# EAGLE design Oraculo V1 (EAGLE 9.4.0)
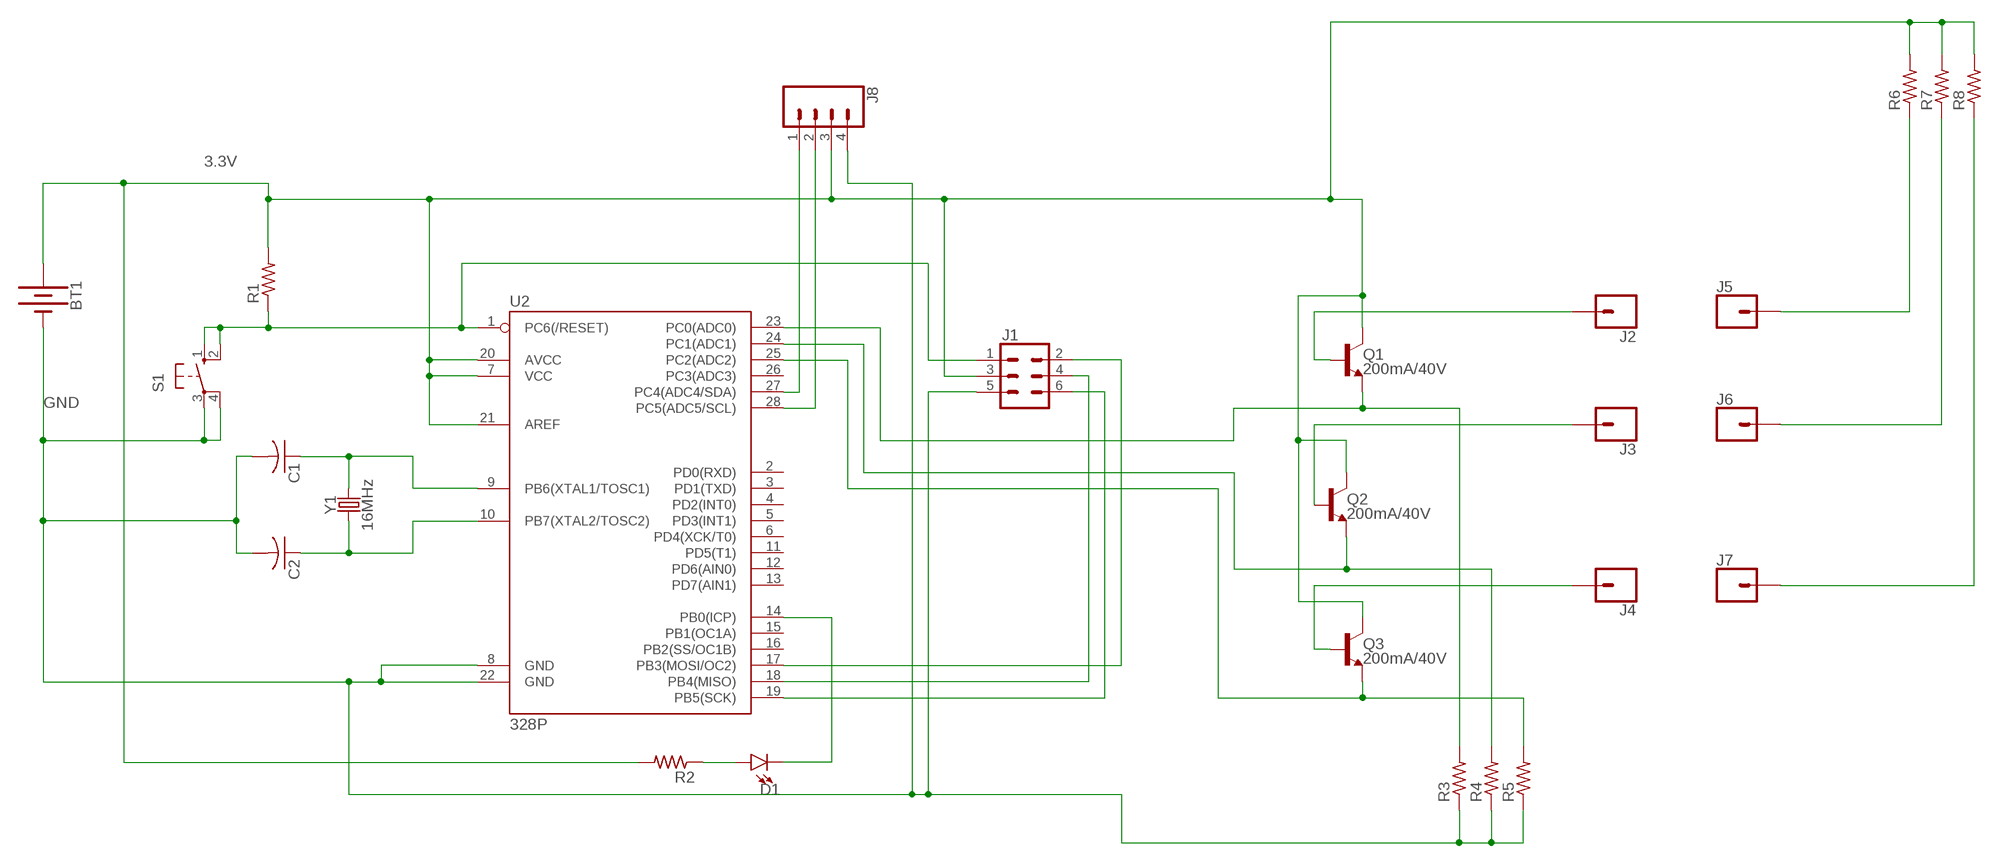
[diagram p0: schematic, sheet 1]

## Parts
BT1  BATTERY-20MM_PTH  [BATTCOM_20MM_PTH]
C1  C-US050-025X075  [C050-025X075]
C2  C-US050-025X075  [C050-025X075]
D1  LED5MM  [LED_5MM]
J1  CONN_03X2NO_SILK  [2X3-NS]
J2  CONN_01  [1X01]
J3  CONN_01  [1X01]
J4  CONN_01  [1X01]
J5  CONN_01  [1X01]
J6  CONN_01  [1X01]
J7  CONN_01  [1X01]
J8  CONN_04  [1X04]
Q1  200mA/40V  TRANS_NPN-2N3904  [TO-92]
Q2  200mA/40V  TRANS_NPN-2N3904  [TO-92]
Q3  200mA/40V  TRANS_NPN-2N3904  [TO-92]
R1  R-US_0204/7  [0204/7]
R2  R-US_0204/7  [0204/7]
R3  R-US_0204/7  [0204/7]
R4  R-US_0204/7  [0204/7]
R5  R-US_0204/7  [0204/7]
R6  R-US_0204/7  [0204/7]
R7  R-US_0204/7  [0204/7]
R8  R-US_0204/7  [0204/7]
S1  10-XX  [B3F-10XX]
U2  328P  ATMEGA328P_PDIP  [DIP28]
Y1  16MHz  CRYSTAL-16MHZPTH-HC49US  [HC49US]

## Nets
3.3V: BT1.1(+) J1.3 J8.3 Q1.3(C) Q2.3(C) Q3.3(C) R1.2 R2.2 R6.2 R7.2 R8.2 U2.7(VCC) U2.20(AVCC) U2.21(AREF)
GND: BT1.2(-) C1.2 C2.2 J1.5 J8.4 R3.1 R4.1 R5.1 S1.3(P) S1.4(P1) U2.8(GND) U2.22(GND)
N$1: C1.1 U2.9(PB6(XTAL1/TOSC1)) Y1.2
N$2: C2.1 U2.10(PB7(XTAL2/TOSC2)) Y1.1
N$3: J1.1 R1.1 S1.1(S) S1.2(S1) U2.1(PC6(/RESET))
N$5: J1.2 U2.17(PB3(MOSI/OC2))
N$7: D1.K(C) U2.14(PB0(ICP))
N$8: J1.6 U2.19(PB5(SCK))
N$9: J1.4 U2.18(PB4(MISO))
N$10: D1.A R2.1
N$11: J8.1 U2.27(PC4(ADC4/SDA))
N$12: J2.1 Q1.2(B)
N$13: J3.1 Q2.2(B)
N$14: J4.1 Q3.2(B)
N$15: Q1.1(E) R3.2 U2.23(PC0(ADC0))
N$16: Q2.1(E) R4.2 U2.24(PC1(ADC1))
N$17: Q3.1(E) R5.2 U2.25(PC2(ADC2))
N$18: J5.1 J6.1 J7.1 R6.1 R7.1 R8.1
N$19: J8.2 U2.28(PC5(ADC5/SCL))
Unconnected: U2.2(PD0(RXD)) U2.3(PD1(TXD)) U2.4(PD2(INT0)) U2.5(PD3(INT1)) U2.6(PD4(XCK/T0)) U2.11(PD5(T1)) U2.12(PD6(AIN0)) U2.13(PD7(AIN1)) U2.15(PB1(OC1A)) U2.16(PB2(SS/OC1B)) U2.26(PC3(ADC3))

## Library data of the parts
BT1 = SparkFun-Batteries:BATTERY: Battery - Single Cell A variety of battery chemistries, sizes, and footprints. Device List: 20MM_PTH - Coin Cell Battery Holder - 20mm (PTH) <https://www.sparkfun.com/products/783> 6.8MM_PTH - Coin Cell Battery Holder - 6.8MM(SMD) <https://www.digikey.com/product-detail/en/seiko-instruments/MS621FE-FL11E/728-1057-ND/1889208?WT.srch=1&gclid=CNOQ5a6LzdQCFZS2wAodXCkE0g> 12MM_SMD - Coin Cell Battery Holder - 12mm (SMD) <https://www.sparkfun.com/products/10592> 12MM_PTH - Coin Cell Battery Holder - 12mm (PTH) <https://www.sparkfun.com/products/7948> 20MM_SMD - 20mm Coin Cell Battery Holder (SMD) (2 legs) Used on the Big Time Watch Kit <https://www.sparkfun.com/products/11734> 20MM_SMD_4LEGS - Coin Cell Battery Holder - 20mm (SMD) <https://www.sparkfun.com/products/11892> 20MM_SMD_4LEGS_OVERPASTE - Coin Cell Battery Holder - 20mm (SMD) <https://www.sparkfun.com/products/11892> (Over-paste on the legs) 24.5MM_PTH - Coin Cell Battery Holder - 24.5mm (PTH) <https://www.sparkfun.com/products/8863> 9V - 9V Battery Holder - PC Mount Used on the SparkFun SparkPunk Sound Kit <https://www.sparkfun.com/products/11177> and SparkFun SparkPunk Sequencer Kit <https://www.sparkfun.com/products/12707> 18650 - Battery Holder - 18650 (PTH) <https://www.sparkfun.com/products/13113> AA - Battery Holder - 1xAA (PTH) <https://www.sparkfun.com/products/7949> AAA - Battery Holder - 1xAAA (PTH) <https://www.sparkfun.com/products/12718> AA_KIT - Battery Holder - 1xAA (PTH) <https://www.sparkfun.com/products/7949> Special kit package - pads only have exposed copper on one side of the board. AAA_KIT - Battery Holder - 1xAAA (PTH) <https://www.sparkfun.com/products/12718> Special kit package - pads only have exposed copper on one side of the board.; PROD_ID: BATT-09031; SF_SKU: PRT-00783
C1 C2 = rcl:C-US: CAPACITOR, American symbol; SPICEPREFIX: C
D1 = SparkFun-LED:LED: LED (Generic) Standard schematic elements and footprints for 5mm, 3mm, 1206, and 0603 sized LEDs. Generic LEDs with no color specified.
J1 = SparkFun-Connectors:CONN_03X2: Multi connection point. Often used as Generic Header-pin footprint for 0.1 inch spaced/style header connections You can populate with any combo of single row headers, but if you'd like an exact match, check these: Header - 2x3 (Male, 0.1") <https://www.sparkfun.com/products/12807> (PRT-12807) Header - 2x3 (Female, 0.1") <https://www.sparkfun.com/products/13010> (PRT-13010) 2x3 Pin Shrouded Header <https://www.sparkfun.com/products/10877> (PRT-10877) On any of the 0.1 inch spaced packages, you can populate with these: Break Away Headers - Straight <https://www.sparkfun.com/products/116> (PRT-00116) Break Away Male Headers - Right Angle <https://www.sparkfun.com/products/553> (PRT-00553) Female Headers <https://www.sparkfun.com/products/115> (PRT-00115) Break Away Headers - Machine Pin <https://www.sparkfun.com/products/117> (PRT-00117) Break Away Female Headers - Swiss Machine Pin <https://www.sparkfun.com/products/743> (PRT-00743) Special note: the shrouded connector mates well with our 3x2 ribbon cables: Ribbon Crimp Connector - 6-pin (2x3, Female) <https://www.sparkfun.com/products/10651> (PRT-10651) Ribbon Cable - 6 wire (15ft) <https://www.sparkfun.com/products/10646> (PRT-10646)
J2-J7 = SparkFun-Connectors:CONN_01: Single connection point. Often used as Generic Header-pin footprint for 0.1 inch spaced/style header connections On any of the 0.1 inch spaced packages, you can populate with these: Break Away Headers - Straight <https://www.sparkfun.com/products/116> (PRT-00116) Break Away Male Headers - Right Angle <https://www.sparkfun.com/products/553> (PRT-00553) Female Headers <https://www.sparkfun.com/products/115> (PRT-00115) Break Away Headers - Machine Pin <https://www.sparkfun.com/products/117> (PRT-00117) Break Away Female Headers - Swiss Machine Pin <https://www.sparkfun.com/products/743> (PRT-00743) This device is also useful as a general connection point to wire up your design to another part of your project. Our various solder wires solder well into these plated through hole pads. Hook-Up Wire - Assortment (Stranded, 22 AWG) <https://www.sparkfun.com/products/11375> (PRT-11375) Hook-Up Wire - Assortment (Solid Core, 22 AWG) <https://www.sparkfun.com/products/11367> (PRT-11367) View the entire wire category on our website here <https://www.sparkfun.com/categories/141> Special notes: SMTSO-256-ET is a "flush mount" nut for a 4-40 screw. We mostly use this on specialty testbeds; it is a nice way to connect hardware to your PCB at an adjustable hieght. Also note, the SNAP packages are for using a snappable style connector. We sell a baggie of snaps and they are also used on two LilyPad designs: Snap Assortment - 30 pack (male and female) <https://www.sparkfun.com/products/11347> (DEV-11347) LilyPad Arduino SimpleSnap <https://www.sparkfun.com/products/10941> (DEV-10941) LilyPad SimpleSnap Protoboard <https://www.sparkfun.com/products/10940> (DEV-10940)
J8 = SparkFun-Connectors:CONN_04: Multi connection point. Often used as Generic Header-pin footprint for 0.1 inch spaced/style header connections On any of the 0.1 inch spaced packages, you can populate with these: Break Away Headers - Straight <https://www.sparkfun.com/products/116> (PRT-00116) Break Away Male Headers - Right Angle <https://www.sparkfun.com/products/553> (PRT-00553) Female Headers <https://www.sparkfun.com/products/115> (PRT-00115) Break Away Headers - Machine Pin <https://www.sparkfun.com/products/117> (PRT-00117) Break Away Female Headers - Swiss Machine Pin <https://www.sparkfun.com/products/743> (PRT-00743) For SCREWTERMINALS and SPRING TERMINALS visit here: Screw Terimnals on SparkFun.com <https://www.sparkfun.com/search/results?term=Screw+Terminals> (5mm/3.5mm/2.54mm spacing) This device is also useful as a general connection point to wire up your design to another part of your project. Our various solder wires solder well into these plated through hole pads. Hook-Up Wire - Assortment (Stranded, 22 AWG) <https://www.sparkfun.com/products/11375> (PRT-11375) Hook-Up Wire - Assortment (Solid Core, 22 AWG) <https://www.sparkfun.com/products/11367> (PRT-11367) View the entire wire category on our website here <https://www.sparkfun.com/categories/141> Special notes: Molex polarized connector foot print use with SKU : PRT-08231 with associated crimp pins and housings. 1MM SMD Version SKU: PRT-10208; PROD_ID: CONN-09696
Q1-Q3 = SparkFun-DiscreteSemi:TRANS_NPN: NPN transistor Current controlled devices typically used to amplify current or used as a switch. BC547 - COM-08928 <http://www.sparkfun.com/products/8928> (TO-92 45V 100mA) (1.Collector 2.Base 3.Emitter) 2N3904 - COM-00521 <http://www.sparkfun.com/products/521> (TO-92 40V 200mA) (1.Emitter 2.Base 3.Collector) P2N2222A - COM-12852 <http://www.sparkfun.com/products/12852> (TO-92 40V 600mA) (1.Collector 2.Base 3.Emitter); PROD_ID: TRANS-08447
R1-R8 = rcl:R-US_: RESISTOR, American symbol; SPICEPREFIX: R
S1 = switch-omron:10-XX: OMRON SWITCH; MPN: B3F-1000; OC_FARNELL: 176432; OC_NEWARK: 36M3542
U2 = SparkFun-IC-Microcontroller:ATMEGA328P_PDIP: Atmel 328P Through hole ATMEGA328P uC used in the Arduino 32kb flash, 1k EEPROM, 2k SRAM Datasheet <http://www.sparkfun.com/datasheets/Components/SMD/ATMega328.pdf> SparkFun Products Storefront component: AVR 28 Pin 20MHz 32K 6A/D - ATMega328P <https://www.sparkfun.com/products/9061> (COM-09061) SparkFun Simon Says - Through-Hole Soldering Kit <https://www.sparkfun.com/products/10547> (KIT-10547) SparkFun Learn to Solder - Simon Says <https://www.sparkfun.com/products/13708> (KIT-13708) SparkFun BigTime Watch Kit <https://www.sparkfun.com/products/11734> (KIT-11734) SparkFun ClockIt <https://www.sparkfun.com/products/10930> (KIT-10930) SparkFun Serial Enabled LCD Kit <https://www.sparkfun.com/products/10097> (LCD-10097) SparkFun Simon Tilts - Through Hole Soldering Kit <https://www.sparkfun.com/products/12634> (KIT-12634) SparkFun Frequency Counter Kit <https://www.sparkfun.com/products/10140> (KIT-10140) FabFM Radio Kit <https://www.sparkfun.com/products/11043> (KIT-11043) SparkFun Binary Blaster Kit <https://www.sparkfun.com/products/12037> (KIT-12037) SparkFun Metro-Gnome <https://www.sparkfun.com/products/9236> (KIT-09236) ATmega328 with Arduino Optiboot (Uno) <https://www.sparkfun.com/products/10524> (DEV-10524); PROD_ID: IC-09136
Y1 = SparkFun-Clocks:CRYSTAL-16MHZ: 16MHz Crystal Digikey Example <http://www.digikey.com/product-search/en?keywords=535-9122-1-ND> Frequency: 16MHz Frequency Stability: ±50ppm Frequency Tolerance: ±20ppm Load Capacitance: 18pF SparkFun Products: Pro Micro -5V/16MHz <https://www.sparkfun.com/products/12640> SparkFun Serial Enabled LCD Kit <https://www.sparkfun.com/products/10097>; PROD_ID: XTAL-08181; SF_ID: COM-00536

## Board
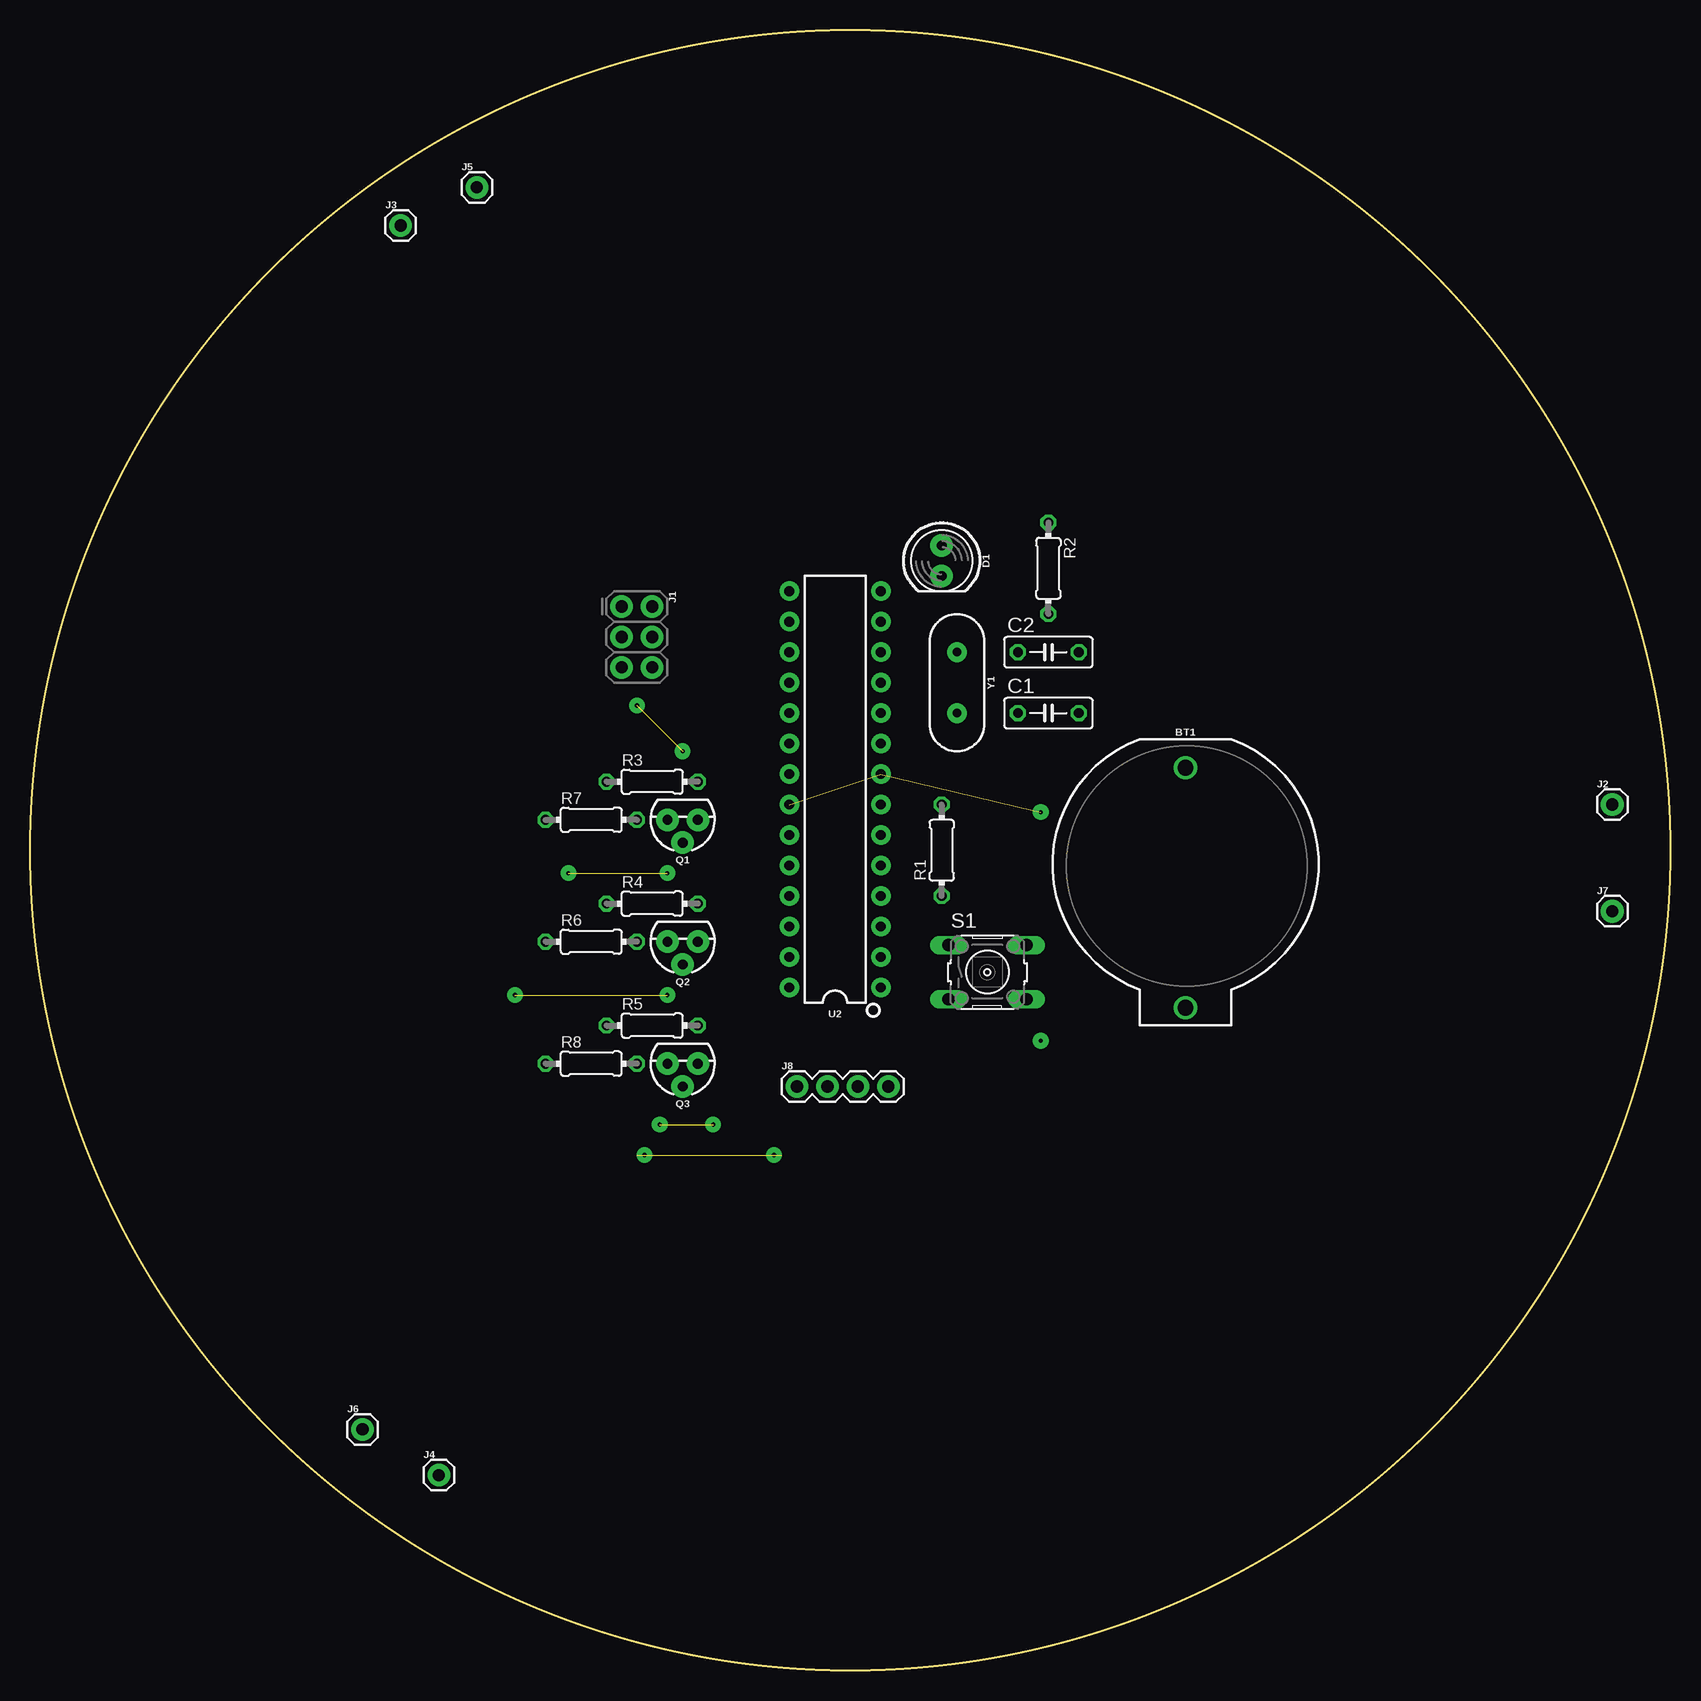
[diagram p1: board, top side]
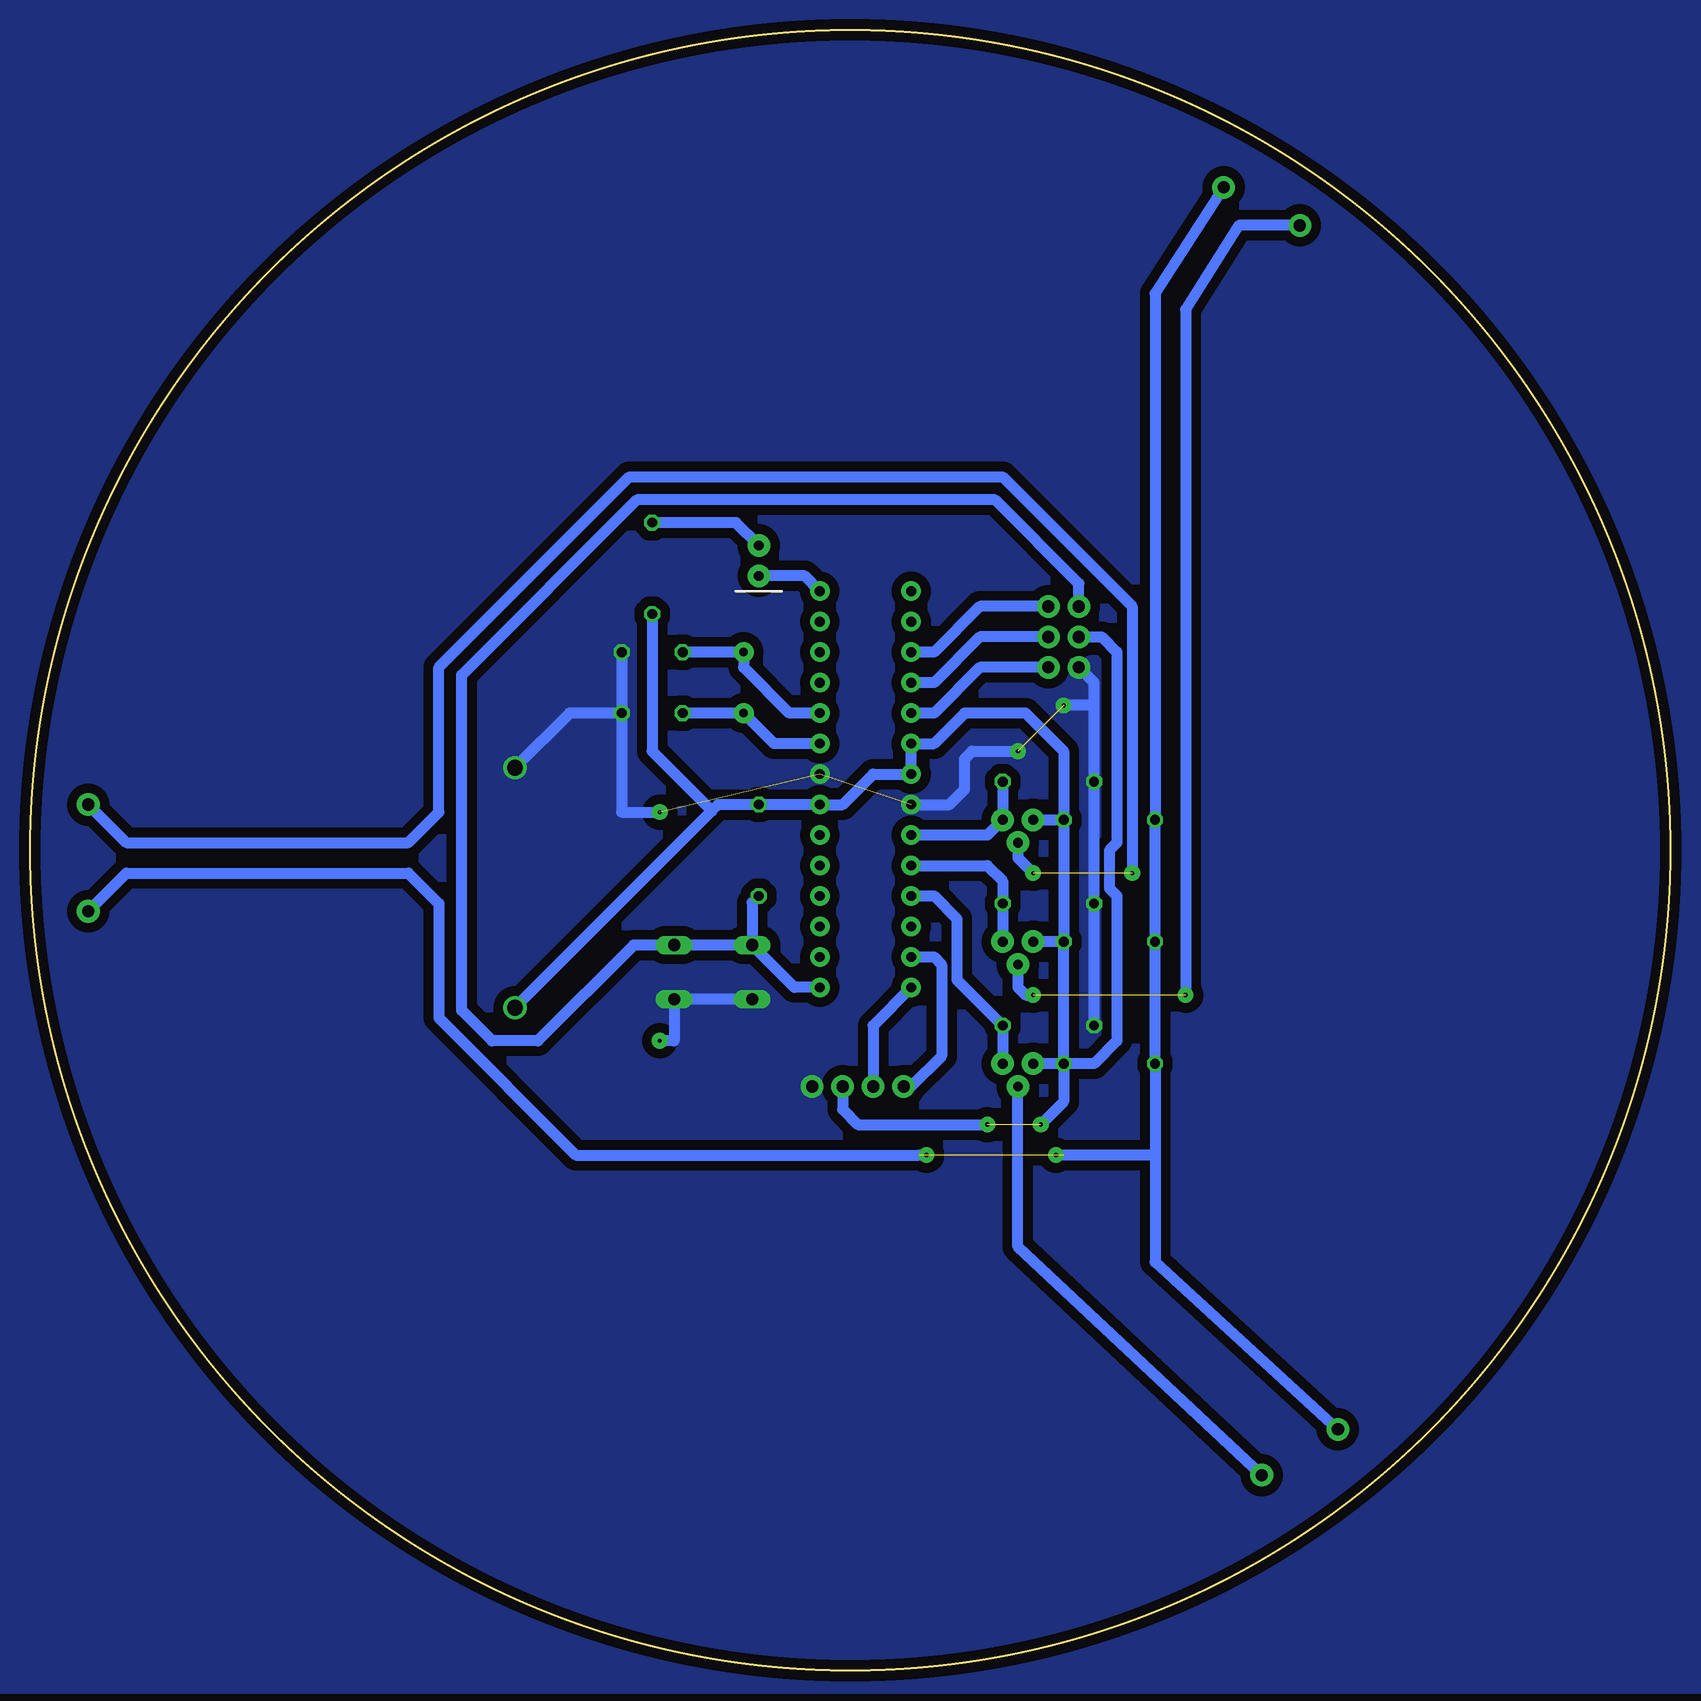
[diagram p2: board, bottom side, seen from below]

Size 136.71 x 136.71 mm. Coordinates in mm from the lower left corner, seen from the top.
Outline: circle at 68.36,68.36 radius 68.36
Copper layers (1*16): Top 0.035mm / dielectric 1.5mm / Bottom 0.035mm
Design rules "default *": minimum track width 36mil, minimum drill 0.35mm, track to track 8mil, track to pad 8mil, pad to pad 8mil, via to via 8mil, smd to smd 8mil, copper to edge 10mil, drill to drill 16mil, minimum pad ring 10mil, minimum via ring 8mil, stop-mask expansion 4mil, vias tented up to drill 0mil, thermal gap 10mil

### Footprints (pad centres in the part's own frame; a part is rotated, then mirrored left to right if it is on the bottom)
BATTCOM_20MM_PTH = drill 1.3: 1 11.85,0; 2 -8.15,0
C050-025X075 = drill 0.813 octagon: 1 -2.54,0; 2 2.54,0
LED_5MM = drill 0.813 pad 1.88: A -1.27,0; K 1.27,0
2X3-NS = drill 1.016 pad 1.88: 1 -2.54,-1.27; 2 -2.54,1.27; 3 0,-1.27; 4 0,1.27; 5 2.54,-1.27; 6 2.54,1.27
1X01 = drill 1.016 pad 1.88: 1 0,0
1X04 = drill 1.016 pad 1.88: 1 0,0; 2 2.54,0; 3 5.08,0; 4 7.62,0
TO-92 = drill 0.813 pad 1.88: 1 -1.27,0; 2 0,1.905; 3 1.27,0
0204/7 = drill 0.813 octagon: 1 -3.81,0; 2 3.81,0
B3F-10XX = drill 1.016 long: 1 -3.251,2.261; 2 3.251,2.261; 3 -3.251,-2.261; 4 3.251,-2.261
DIP28 = drill 0.813 pad 1.626: 1 -16.51,-3.81; 2 -13.97,-3.81; 3 -11.43,-3.81; 4 -8.89,-3.81; 5 -6.35,-3.81; 6 -3.81,-3.81; 7 -1.27,-3.81; 8 1.27,-3.81; 9 3.81,-3.81; 10 6.35,-3.81; 11 8.89,-3.81; 12 11.43,-3.81; 13 13.97,-3.81; 14 16.51,-3.81; 15 16.51,3.81; 16 13.97,3.81; 17 11.43,3.81; 18 8.89,3.81; 19 6.35,3.81; 20 3.81,3.81; 21 1.27,3.81; 22 -1.27,3.81; 23 -3.81,3.81; 24 -6.35,3.81; 25 -8.89,3.81; 26 -11.43,3.81; 27 -13.97,3.81; 28 -16.51,3.81
HC49US = drill 0.7 pad 1.651: 1 -2.54,0; 2 2.54,0

### Placement (x,y rotation side)
BT1  96.3,67.09 270 top
C1  84.87,79.79 0 top
C2  84.87,84.87 0 top
D1  75.98,92.49 270 top
J1  50.58,86.14 270 top
J2  131.86,72.17 0 top
J3  30.89,120.43 0 top
J4  34.07,16.29 0 top
J5  37.24,123.6 0 top
J6  27.72,20.1 0 top
J7  131.86,63.28 0 top
J8  63.91,48.67 0 top
Q1  54.39,70.9 180 top
Q2  54.39,60.74 180 top
Q3  54.39,50.58 180 top
R1  75.98,68.36 90 top
R2  84.87,91.85 270 top
R3  51.85,74.07 0 top
R4  51.85,63.91 0 top
R5  51.85,53.75 0 top
R6  46.77,60.74 0 top
R7  46.77,70.9 0 top
R8  46.77,50.58 0 top
S1  79.79,58.2 0 top
U2  67.09,73.44 90 top
Y1  77.25,82.33 270 top

### Tracks (layer width: path | path; a pad name or v marks a point on that pad's centre or on a via)
3.3V  (via drill 0.35 pad 1.3)  (1 unrouted)
  Bottom 0.914: 79.89,71.64 79.37,72.17 R1.2 U2.7 68.99,72.17 66.45,74.71 U2.21 U2.20 61.37,77.25 58.83,79.79 53.75,79.79 50.58,76.61 R7.2 | 79.89,71.64 BT1.1 | R2.2 84.87,76.61 79.89,71.64 | R8.2 Q3.3 | Q1.3 R7.2 | R7.2 R6.2 | R6.2 Q2.3 | R8.2 R6.2 | R8.2 48.04,50.58 46.13,52.48 46.13,64.55 46.77,65.18 46.77,68.36 46.13,68.99 46.13,84.87 47.4,86.14 J1.3 | J8.3 68.99,46.77 67.72,45.5 v56.93,45.5 | R8.2 50.58,47.4 v52.48,45.5
GND  (via drill 0.35 pad 1.3)  (3 unrouted)
  Bottom 0.914: S1.3 S1.4 83.04,52.48 84.23,52.48 | C2.2 C1.2 | C1.2 91.75,79.79 BT1.2 | 48.04,80.42 R3.1 R4.1 R5.1 | 48.04,80.42 48.04,82.33 J1.5 | 48.04,80.42 v50.58,80.42 | U2.22 60.1,72.17 58.83,73.44 58.83,75.98 58.2,76.61 v54.39,76.61 | C1.2 87.41,71.53 84.23,71.53
  pour Bottom (isolate 0.813, no thermals): -8.48,152.18 149.27,152.18 150.27,151.18 150.27,-1.49 -7.48,-1.49 -8.48,-0.49 -8.48,151.54
N$1
  Bottom 0.914: U2.9 74.71,77.25 Y1.2 C1.1
N$2
  Bottom 0.914: U2.10 73.44,79.79 77.25,83.6 Y1.1 C2.1
N$3
  Bottom 0.914: R1.1 76.54,63.99 S1.1 | S1.1 S1.2 86.42,60.46 94.39,52.48 98.2,52.48 100.74,55.02 100.74,82.96 86.14,97.57 56.29,97.57 49.31,90.58 J1.1 | S1.1 73,56.93 U2.1
N$4  (via drill 0.35 pad 1.3)
  other vias: 51.21,42.96
N$5
  Bottom 0.914: J1.2 57.56,88.68 61.37,84.87 U2.17
N$6  (via drill 0.35 pad 1.3)
  other vias: 62.01,42.96
N$7
  Bottom 0.914: U2.14 72.17,91.22 D1.K
N$8
  Bottom 0.914: J1.6 57.56,83.6 61.37,79.79 U2.19
N$9
  Bottom 0.914: J1.4 57.56,86.14 61.37,82.33 U2.18
N$10
  Bottom 0.914: D1.A 77.88,95.66 R2.1
N$11
  Bottom 0.914: U2.27 61.37,59.47 60.74,58.83 60.74,51.21 63.28,48.67 J8.1
N$12  (via drill 0.35 pad 1.3)  (1 unrouted)
  Bottom 0.914: J2.1 128.68,68.99 105.19,68.99 102.65,71.53 102.65,83.6 86.77,99.47 55.66,99.47 44.86,88.68 v44.86,66.45 | Q1.2 54.39,67.72 v53.12,66.45
N$13  (via drill 0.35 pad 1.3)  (1 unrouted)
  Bottom 0.914: J3.1 35.97,120.43 40.42,113.44 v40.42,56.29 | Q2.2 54.39,56.93 53.75,56.29 v53.12,56.29
N$14
  Bottom 0.914: J4.1 54.39,35.34 Q3.2
N$15
  Bottom 0.914: R3.2 Q1.1 56.93,69.63 U2.23
N$16
  Bottom 0.914: Q2.1 R4.2 55.66,65.82 56.93,67.09 U2.24
N$17
  Bottom 0.914: Q3.1 R5.2 59.47,57.56 59.47,62.64 61.37,64.55 U2.25
N$18  (1 unrouted)
  Bottom 0.914: 42.96,42.96 R8.1 R6.1 R7.1 42.96,114.77 J5.1 | 42.96,42.96 42.96,34.07 J6.1 | J7.1 128.68,66.45 105.19,66.45 102.65,63.91 102.65,54.39 91.22,42.96 62.64,42.96 | 42.96,42.96 50.58,42.96
N$19
  Bottom 0.914: J8.2 66.45,53.75 U2.28
N$20  (via drill 0.35 pad 1.3)
  other vias: 84.23,71.53
N$21  (via drill 0.35 pad 1.3)
  other vias: 84.23,52.48